# Altium schematic sheet LuxLogger_V2_mcu_pwr.SchDoc: LuxLogger V2
size A3; Engineer: ChEn; SheetNumber: 1; SheetTotal: 2
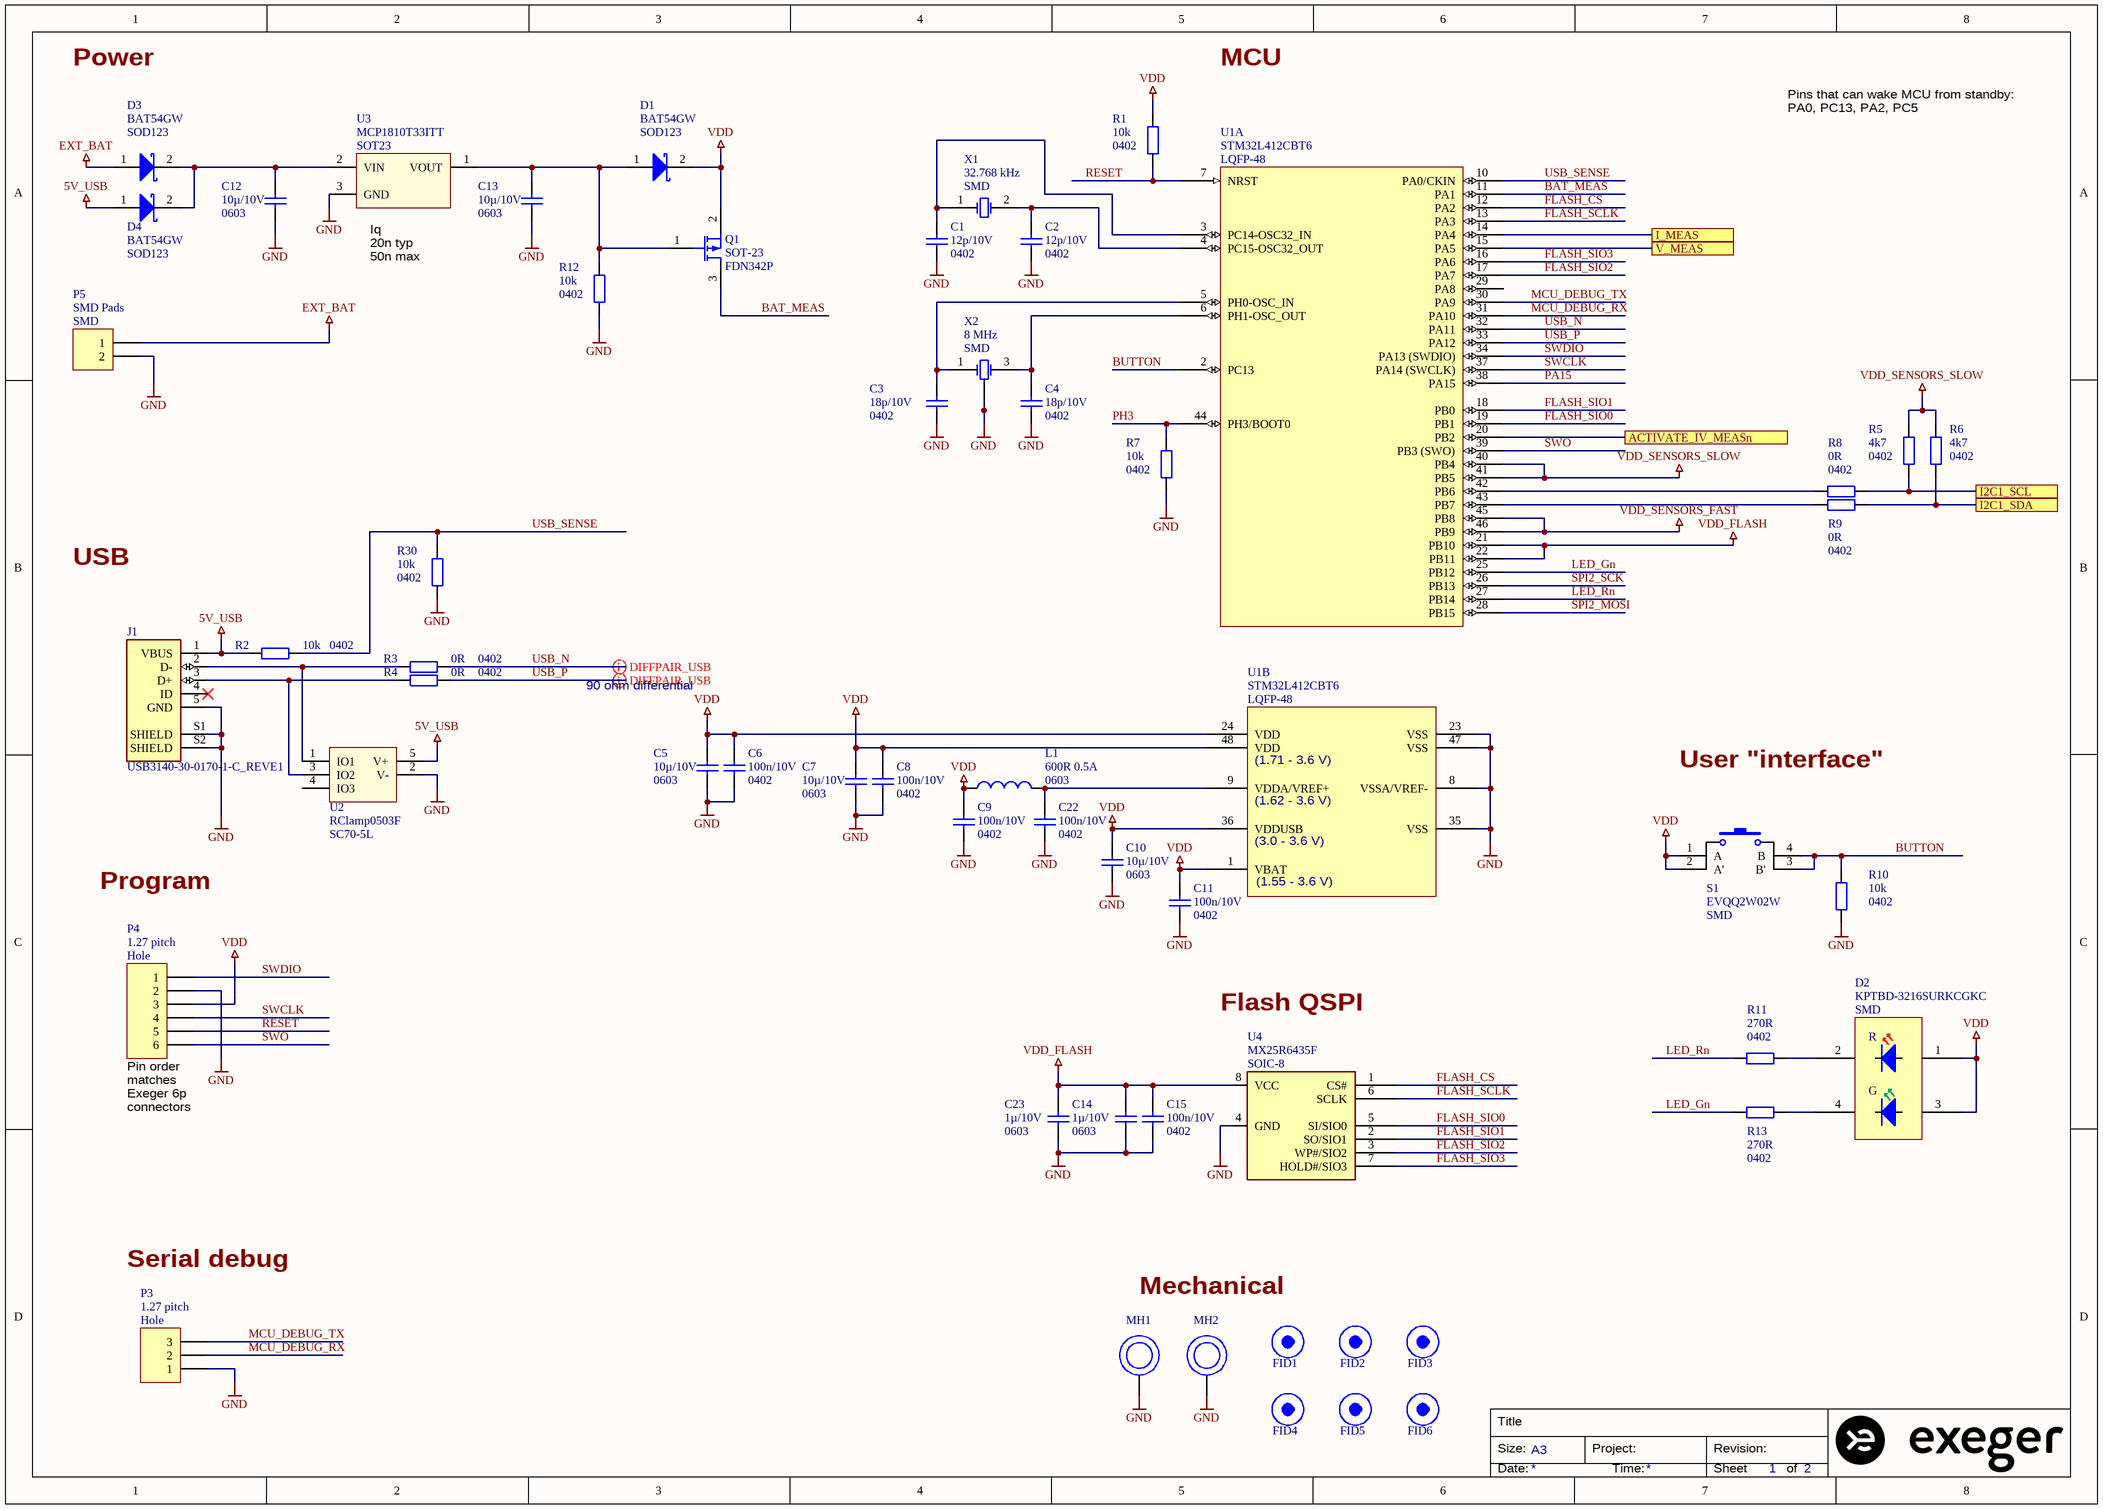
[diagram p0: LuxLogger_V2_mcu_pwr.SchDoc]

## Parts
C1  Specification: 12p/10V  Package: 0402  [CAP0402]
C2  Specification: 12p/10V  Package: 0402  [CAP0402]
C3  Specification: 18p/10V  Package: 0402  [CAP0402]
C4  Specification: 18p/10V  Package: 0402  [CAP0402]
C5  Specification: 10µ/10V  Package: 0603  [CAP0603]
C6  Specification: 100n/10V  Package: 0402  [CAP0402]
C7  Specification: 10µ/10V  Package: 0603  [CAP0603]
C8  Specification: 100n/10V  Package: 0402  [CAP0402]
C9  Specification: 100n/10V  Package: 0402  [CAP0402]
C10  Specification: 10µ/10V  Package: 0603  [CAP0603]
C11  Specification: 100n/10V  Package: 0402  [CAP0402]
C12  Specification: 10µ/10V  Package: 0603  [CAP0603]
C13  Specification: 10µ/10V  Package: 0603  [CAP0603]
C14  Specification: 1µ/10V  Package: 0603  [CAP0603]
C15  Specification: 100n/10V  Package: 0402  [CAP0402]
C22  Specification: 100n/10V  Package: 0402  [CAP0402]
C23  Specification: 1µ/10V  Package: 0603  [CAP0603]
D1  Package: SOD123  Specification: BAT54GW  [SOD123 SODFL360X130-2N]  (hidden comment: Alternative ON BAT54T1GOSCT-ND)
D2  Package: SMD  [KPTBD-3216SURKCGKC]
D3  Package: SOD123  Specification: BAT54GW  [SOD123 SODFL360X130-2N]  (hidden comment: Alternative ON BAT54T1GOSCT-ND)
D4  Package: SOD123  Specification: BAT54GW  [SOD123 SODFL360X130-2N]  (hidden comment: Alternative ON BAT54T1GOSCT-ND)
FID1  Fiducial  [FIDUCIAL_02_small]  (value not drawn)  (no BOM)
FID2  Fiducial  [FIDUCIAL_02_small]  (value not drawn)  (no BOM)
FID3  Fiducial  [FIDUCIAL_02_small]  (value not drawn)  (no BOM)
FID4  Fiducial  [FIDUCIAL_02_small]  (value not drawn)  (no BOM)
FID5  Fiducial  [FIDUCIAL_02_small]  (value not drawn)  (no BOM)
FID6  Fiducial  [FIDUCIAL_02_small]  (value not drawn)  (no BOM)
J1  USB3140-30-0170-1-C_REVE1  [GCT_USB3140-30-0170-1-C_REVE1]
L1  Specification: 600R 0.5A  Package: 0603  [CAP0603]
MH1  Mounting hole  [HOLE_PLATED_2300um]  (value not drawn)  (no BOM)
MH2  Mounting hole  [HOLE_PLATED_2300um]  (value not drawn)  (no BOM)
P3  Package: Hole  Specification: 1.27 pitch  [Header 1x3 1.27]  (no BOM)
P4  Package: Hole  Specification: 1.27 pitch  [Header 1x6 1.27]  (no BOM)
P5  Package: SMD  Specification: SMD Pads  [2x1 blank pads_2]  (no BOM)
Q1  Package: SOT-23  Specification: FDN342P  [SOT23-3]
R1  Package: 0402  Specification: 10k  [RES0402]
R2  Package: 0402  Specification: 10k  [RES0402]
R3  Package: 0402  Specification: 0R  [RES0402]
R4  Package: 0402  Specification: 0R  [RES0402]
R5  Package: 0402  Specification: 4k7  [RES0402]
R6  Package: 0402  Specification: 4k7  [RES0402]
R7  Package: 0402  Specification: 10k  [RES0402]
R8  Package: 0402  Specification: 0R  [RES0402]
R9  Package: 0402  Specification: 0R  [RES0402]
R10  Package: 0402  Specification: 10k  [RES0402]
R11  Package: 0402  Specification: 270R  [RES0402]
R12  Package: 0402  Specification: 10k  [RES0402]
R13  Package: 0402  Specification: 270R  [RES0402]
R30  Package: 0402  Specification: 10k  [RES0402]
S1  Package: SMD  [EVQQ2W02W]
U1  Specification: STM32L412CBT6  Package: LQFP-48  [TSQFP50P900X900X160-48N]  (parts A,B of 2)
U2  Package: SC70-5L  [SC-70 5L]
U3  Specification: MCP1810T33ITT  Package: SOT23  [SOT23-3]
U4  Package: SOIC-8  Specification: MX25R6435F  [SO_8_W]
X1  Package: SMD  Specification: 32.768 kHz  [FC-135]
X2  Specification: 8 MHz  Package: SMD  [ABM3B]

## Ports
ACTIVATE_IV_MEASn, I2C1_SCL, I2C1_SDA, I_MEAS, V_MEAS

## Nets
5V_USB: D4.1(A) J1.1(VBUS) R2.2 U2.5(V+)
EXT_BAT: D3.1(A) P5.1
GND: C1.1 C2.1 C3.1 C4.1 C5.1 C6.1 C7.1 C8.1 C9.1 C10.1 C11.1 C12.1 C13.1 C14.1 C15.1 C22.1 C23.1 J1.5(GND) J1.S1(SHIELD) J1.S2(SHIELD) MH1.1 MH2.1 P3.1 P4.2 P5.2 R7.1 R10.1 R12.1 R30.1 U1.8(VSSA/VREF-) U1.23(VSS) U1.35(VSS) U1.47(VSS) U2.2(V-) U3.3(GND) U4.4(GND) X2.2(GND) X2.4(GND)
VDD: C5.2 C6.2 C7.2 C8.2 C9.2 C10.2 C11.2 D1.2(K) D2.1(R_A) D2.3(G_A) L1.1 P4.3 Q1.2(S) R1.2 S1.1(A) S1.2(A') U1.1(VBAT) U1.24(VDD) U1.36(VDDUSB) U1.48(VDD)
VDD_FLASH: C14.2 C15.2 C23.2 U1.21(PB10) U1.22(PB11) U4.8(VCC)
VDD_SENSORS_FAST: U1.45(PB8) U1.46(PB9)
VDD_SENSORS_SLOW: R5.2 R6.2 U1.40(PB4) U1.41(PB5)
ACTIVATE_IV_MEASn: U1.20(PB2) ; port ACTIVATE_IV_MEASn
BAT_MEAS: Q1.3(D) U1.11(PA1)
BUTTON: R10.2 S1.3(B') S1.4(B) U1.2(PC13)
FLASH_CS: U1.12(PA2) U4.1(CS#)
FLASH_SCLK: U1.13(PA3) U4.6(SCLK)
FLASH_SIO0: U1.19(PB1) U4.5(SI/SIO0)
FLASH_SIO1: U1.18(PB0) U4.2(SO/SIO1)
FLASH_SIO2: U1.17(PA7) U4.3(WP#/SIO2)
FLASH_SIO3: U1.16(PA6) U4.7(HOLD#/SIO3)
I2C1_SCL: R5.1 R8.1 ; port I2C1_SCL
I2C1_SDA: R6.1 R9.1 ; port I2C1_SDA
I_MEAS: U1.14(PA4) ; port I_MEAS
LED_Gn: R13.2 U1.25(PB12)
LED_Rn: R11.2 U1.27(PB14)
MCU_DEBUG_RX: P3.2 U1.31(PA10)
MCU_DEBUG_TX: P3.3 U1.30(PA9)
PA15: U1.38(PA15)
PH3: R7.2 U1.44(PH3/BOOT0)
RESET: P4.5 R1.1 U1.7(NRST)
SPI2_MOSI: U1.28(PB15)
SPI2_SCK: U1.26(PB13)
SWCLK: P4.4 U1.37(PA14_(SWCLK))
SWDIO: P4.1 U1.34(PA13_(SWDIO))
SWO: P4.6 U1.39(PB3_(SWO))
USB_N: R3.1 U1.32(PA11)
USB_P: R4.1 U1.33(PA12)
USB_SENSE: R2.1 R30.2 U1.10(PA0/CKIN)
V_MEAS: U1.15(PA5) ; port V_MEAS
NetC1_2: C1.2 U1.3(PC14-OSC32_IN) X1.1(OSC1)
NetC2_2: C2.2 U1.4(PC15-OSC32_OUT) X1.2(OSC2)
NetC3_2: C3.2 U1.5(PH0-OSC_IN) X2.1(OSC1)
NetC4_2: C4.2 U1.6(PH1-OSC_OUT) X2.3(OSC2)
NetC12_2: C12.2 D3.2(K) D4.2(K) U3.2(VIN)
NetC13_2: C13.2 D1.1(A) Q1.1(G) R12.2 U3.1(VOUT)
NetC22_2: C22.2 L1.2 U1.9(VDDA/VREF+)
NetD2_2: D2.2(R_K) R11.1
NetD2_4: D2.4(G_K) R13.1
NetJ1_2: J1.2(D-) R3.2 U2.1(IO1)
NetJ1_3: J1.3(D+) R4.2 U2.3(IO2)
NetR8_2: R8.2 U1.42(PB6)
NetR9_2: R9.2 U1.43(PB7)

Not connected (* = marked no-connect by the designer): J1 4(ID)*; U1 29(PA8); U2 4(IO3)

## Layout directives
differential pair: USB_N, USB_P

## Notes on the sheet
- Power
- MCU
- Pins that can wake MCU from standby:
  PA0, PC13, PA2, PC5
- (near U3) Iq
  20n typ
  50n max
- USB
- 90 ohm differential
- User "interface"
- Program
- Flash QSPI
- (near P4) Pin order matches Exeger 6p connectors
- Serial debug
- Mechanical
- Title
- Size:
- A3
- Project:
- Revision:
- Date:
- Time:
- Sheet
- of
- (in symbol LED_RG) R; G
- (in symbol STM32L412CB_2, part B) (1.71 - 3.6 V); (1.62 - 3.6 V); (3.0 - 3.6 V); (1.55 - 3.6 V)

## Library data of the parts
C1-C15 C22 C23 = Cap: Capacitor
D1 D3 D4 = D Schottky: Schottky Diode; Manufacturer: NEXPERIA; Manufacturer PN: BAT54GW
D2 = LED_RG: Red/green LED; Manufacturer: KINGBRIGHT; Manufacturer PN: KPTBD-3216SURKCGKC; Specification: KPTBD-3216SURKCGKC
J1 = USB3140-30-0170-1-C_REVE1: USB - micro B USB 2.0 Receptacle Connector 5 Position Surface Mount, Through Hole; MF: Global Connector Technology; SnapEDA_Link: https://www.snapeda.com/parts/USB3140-30-0170-1-C/Global%20Connector%20Technology/view-part/222535/?ref=snap; Availability: Warning; DigiKey-Purchase-URL: https://snapeda.com/shop?store=DigiKey&id=222535; Package: None; Price: None; MP: USB3140-30-0170-1-C; Value: *; Check_prices: https://www.snapeda.com/parts/USB3140-30-0170-1-C/Global%20Connector%20Technology/view-part/222535/?ref=eda
L1 = Inductor: Manufacturer PN: BLM18AG601SN1D; Manufacturer: MURATA
P3 = Header 3: Header, 3-Pin
P4 = Header 6: Header, 6-Pin
P5 = Header 2: Header, 2-Pin
Q1 = MOSFET-P: P-Channel MOSFET; Manufacturer: ON; Manufacturer PN: FDN342P
R1-R13 R30 = Res2: Resistor
S1 = SW_EVQQ2: Switch; Manufacturer: PANASONIC; Manufacturer PN: EVQQ2W02W; Specification: EVQQ2W02W
U1 = STM32L412CB_2: MCU; Manufacturer: ST; Manufacturer PN: STM32L412CBT6
U2 = RClamp0503F: TVS array USB; Manufacturer: SEMTECH; Manufacturer PN: RClamp0503F.TCT; Specification: RClamp0503F
U3 = MCP1810TxxxTT: 3V3 LDO low iq; Manufacturer: MICROCHIP; Manufacturer PN: MCP1810T33ITT
U4 = MX25R6435F_SO8: ULTRA LOW POWER, 64M-BIT FLASH MEMORY; Manufacturer: Macronix; Manufacturer PN: MX25R6435FM2IL0
X1 = XTAL 2pin: 32.768 kHz Crystal; Manufacturer: EPSON; Manufacturer PN: FC-135 32.7680KA-A5
X2 = XTAL 4pin: Crystal; Manufacturer: ABRACON; Manufacturer PN: ABM3B-8.000MHZ-B2-T